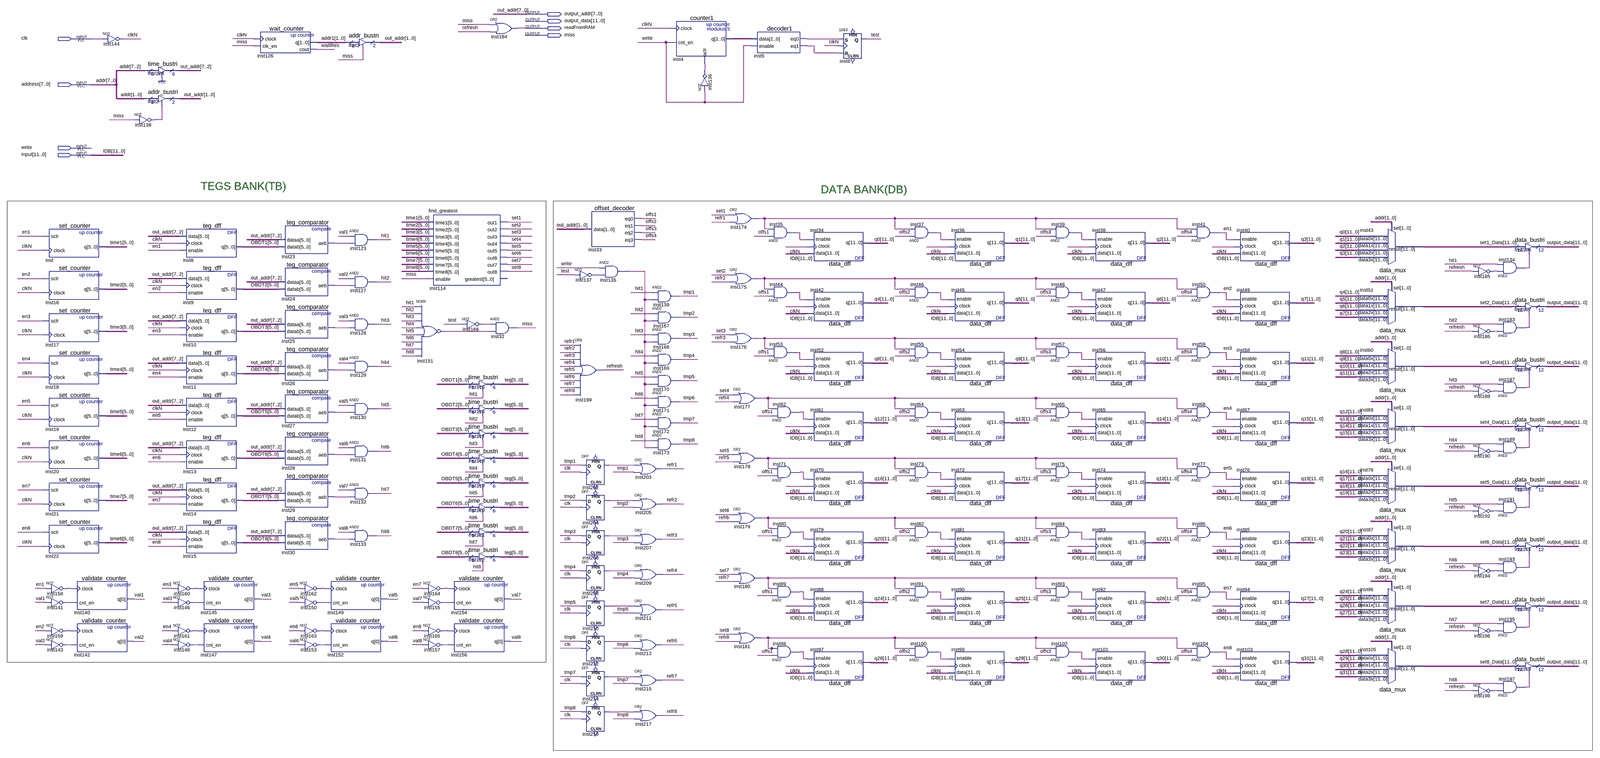
[diagram p0: schematic sheet, whole]
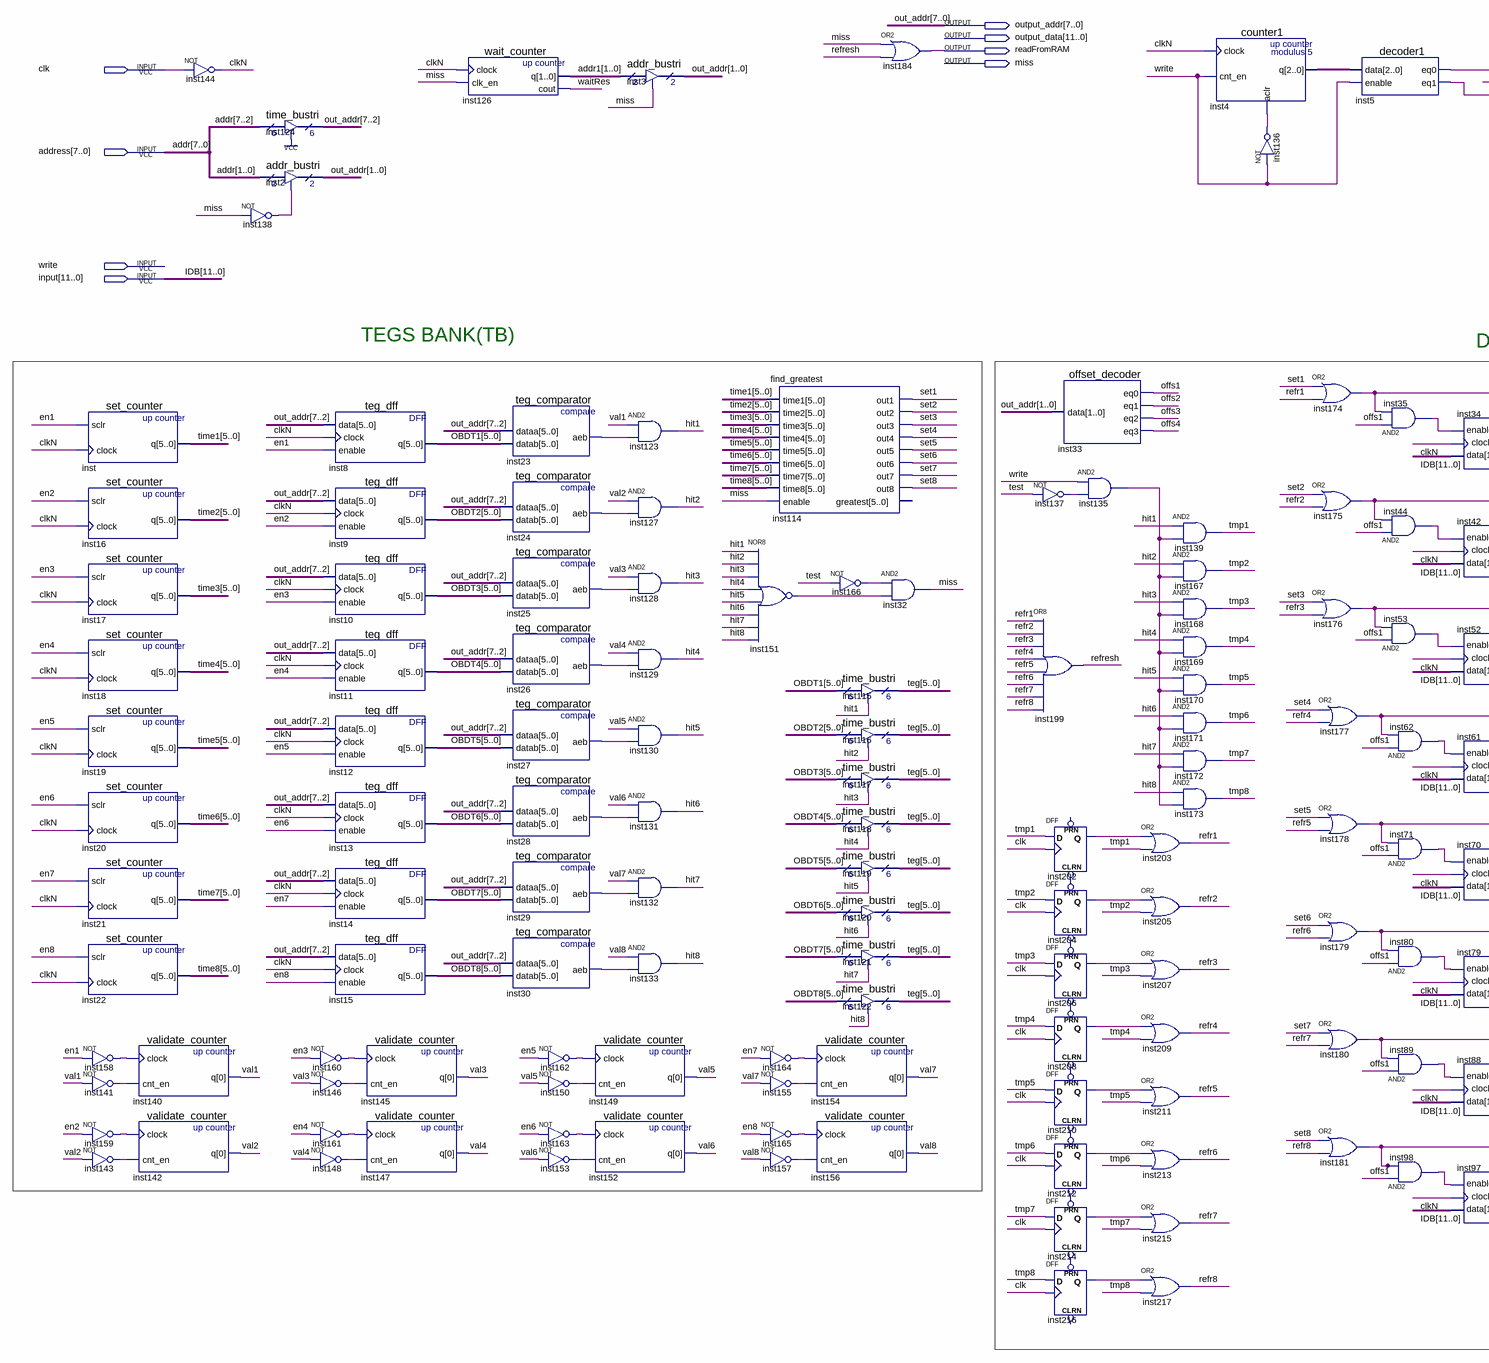
[diagram p1: schematic sheet, left part]
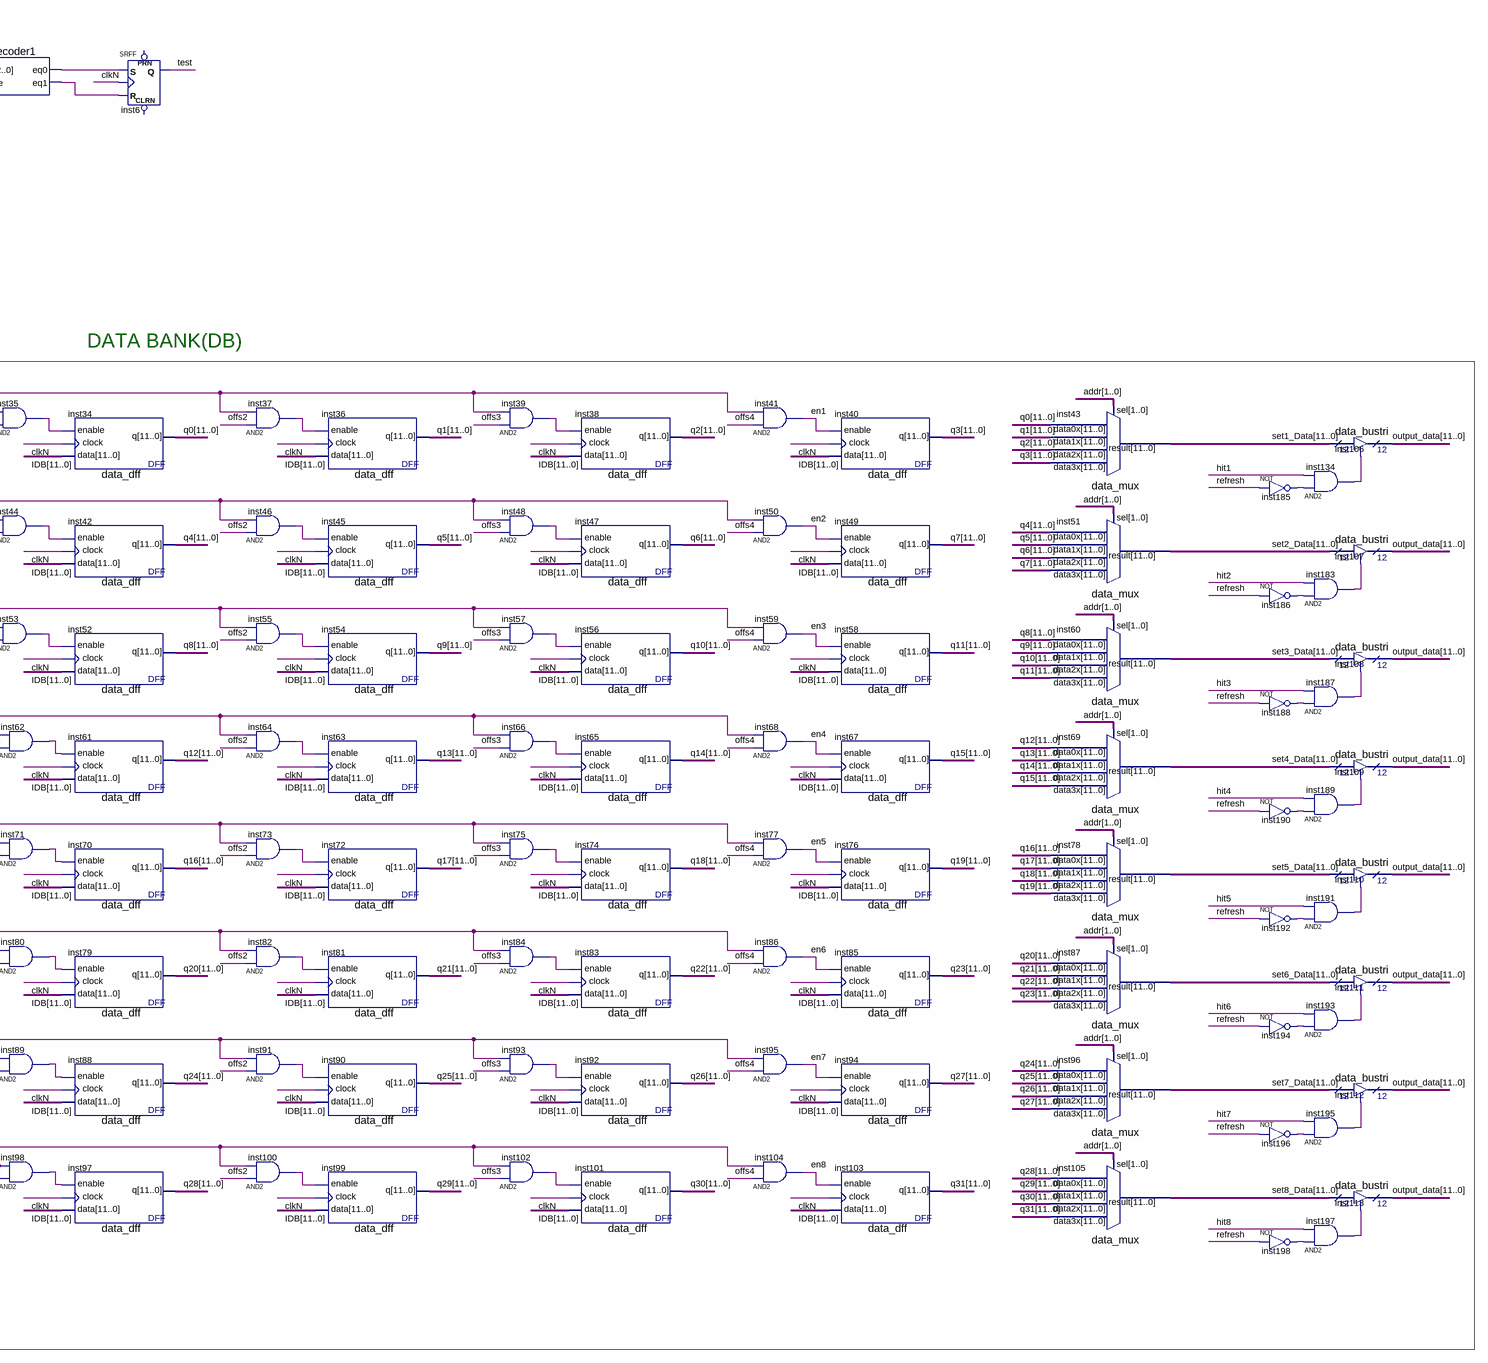
[diagram p2: schematic sheet, right part]
// Quartus schematic Cache.bdf as structural Verilog: 211 symbols, 8 pins
module Cache (
  input  clk,
  input  [7:0] address,
  input  write,
  input  [11:0] \input ,
  output [7:0] output_addr,
  output [11:0] output_data,
  output readFromRAM,
  output miss
);

  wire clkN, en1, en2, en3, en4, en5, en6, en7, en8, hit1, hit2, hit3, hit4, hit5, hit6, hit7, hit8,
       inst5_eq0, inst5_eq1, inst23_aeb, inst24_aeb, inst25_aeb, inst26_aeb, inst27_aeb, inst28_aeb,
       inst29_aeb, inst30_aeb, inst35_out, inst37_out, inst39_out, inst44_out, inst46_out, inst48_out,
       inst53_out, inst55_out, inst57_out, inst62_out, inst64_out, inst66_out, inst71_out, inst73_out,
       inst75_out, inst80_out, inst82_out, inst84_out, inst89_out, inst91_out, inst93_out, inst98_out,
       inst100_out, inst102_out, inst134_out, inst135_out, inst136_out, inst137_out, inst138_out,
       inst141_out, inst143_out, inst146_out, inst148_out, inst150_out, inst151_out, inst153_out,
       inst155_out, inst157_out, inst158_out, inst159_out, inst160_out, inst161_out, inst162_out,
       inst163_out, inst164_out, inst165_out, inst166_out, inst174_out, inst175_out, inst176_out,
       inst177_out, inst178_out, inst179_out, inst180_out, inst181_out, inst183_out, inst185_out,
       inst186_out, inst187_out, inst188_out, inst189_out, inst190_out, inst191_out, inst192_out,
       inst193_out, inst194_out, inst195_out, inst196_out, inst197_out, inst198_out, inst202_q, inst204_q,
       inst206_q, inst208_q, inst210_q, inst212_q, inst214_q, inst216_q, offs1, offs2, offs3, offs4, refr1,
       refr2, refr3, refr4, refr5, refr6, refr7, refr8, refresh, set1, set2, set3, set4, set5, set6, set7,
       set8, test, tmp1, tmp2, tmp3, tmp4, tmp5, tmp6, tmp7, tmp8, undriven, undriven_2, undriven_3,
       undriven_4, undriven_5, undriven_6, undriven_7, val1, val2, val3, val4, val5, val6, val7, val8,
       waitRes;
  wire [1:0] addr1;
  wire [2:0] inst4_q;
  wire [5:0] OBDT1, OBDT2, OBDT3, OBDT4, OBDT5, OBDT6, OBDT7, OBDT8, teg, time1, time2, time3, time4, time5,
       time6, time7, time8;
  wire [11:0] q0, q1, q2, q3, q4, q5, q6, q7, q8, q9, q10, q11, q12, q13, q14, q15, q16, q17, q18, q19, q20,
       q21, q22, q23, q24, q25, q26, q27, q28, q29, q30, q31, set1_Data, set2_Data, set3_Data, set4_Data,
       set5_Data, set6_Data, set7_Data, set8_Data;

  set_counter inst (.sclr(en1), .clock(clkN), .q(time1));
  set_counter inst16 (.sclr(en2), .clock(clkN), .q(time2));
  set_counter inst17 (.sclr(en3), .clock(clkN), .q(time3));
  set_counter inst18 (.sclr(en4), .clock(clkN), .q(time4));
  set_counter inst19 (.sclr(en5), .clock(clkN), .q(time5));
  set_counter inst20 (.sclr(en6), .clock(clkN), .q(time6));
  set_counter inst21 (.sclr(en7), .clock(clkN), .q(time7));
  set_counter inst22 (.sclr(en8), .clock(clkN), .q(time8));
  not inst158 (inst158_out, en1);
  not inst141 (inst141_out, val1);
  not inst159 (inst159_out, en2);
  not inst143 (inst143_out, val2);
  validate_counter inst140 (.clock(inst158_out), .cnt_en(inst141_out), .q(val1));
  validate_counter inst142 (.clock(inst159_out), .cnt_en(inst143_out), .q(val2));
  not inst144 (clkN, clk);
  not inst138 (inst138_out, miss);
  time_bustri inst124 (.enabledt(1'b1), .data(address[7:2]), .tridata(output_addr[7:2]));
  addr_bustri inst2 (.enabledt(inst138_out), .data(address[1:0]), .tridata(output_addr[1:0]));
  teg_dff inst8 (.data(output_addr[7:2]), .clock(clkN), .enable(en1), .q(OBDT1));
  teg_dff inst9 (.data(output_addr[7:2]), .clock(clkN), .enable(en2), .q(OBDT2));
  teg_dff inst10 (.data(output_addr[7:2]), .clock(clkN), .enable(en3), .q(OBDT3));
  teg_dff inst11 (.data(output_addr[7:2]), .clock(clkN), .enable(en4), .q(OBDT4));
  teg_dff inst12 (.data(output_addr[7:2]), .clock(clkN), .enable(en5), .q(OBDT5));
  teg_dff inst13 (.data(output_addr[7:2]), .clock(clkN), .enable(en6), .q(OBDT6));
  teg_dff inst14 (.data(output_addr[7:2]), .clock(clkN), .enable(en7), .q(OBDT7));
  teg_dff inst15 (.data(output_addr[7:2]), .clock(clkN), .enable(en8), .q(OBDT8));
  validate_counter inst145 (.clock(inst160_out), .cnt_en(inst146_out), .q(val3));
  not inst160 (inst160_out, en3);
  not inst146 (inst146_out, val3);
  validate_counter inst147 (.clock(inst161_out), .cnt_en(inst148_out), .q(val4));
  not inst161 (inst161_out, en4);
  not inst148 (inst148_out, val4);
  wait_counter inst126 (.clock(clkN), .clk_en(miss), .q(addr1), .cout(waitRes));
  teg_comparator inst23 (.dataa(output_addr[7:2]), .datab(OBDT1), .aeb(inst23_aeb));
  teg_comparator inst24 (.dataa(output_addr[7:2]), .datab(OBDT2), .aeb(inst24_aeb));
  teg_comparator inst25 (.dataa(output_addr[7:2]), .datab(OBDT3), .aeb(inst25_aeb));
  teg_comparator inst26 (.dataa(output_addr[7:2]), .datab(OBDT4), .aeb(inst26_aeb));
  teg_comparator inst27 (.dataa(output_addr[7:2]), .datab(OBDT5), .aeb(inst27_aeb));
  teg_comparator inst28 (.dataa(output_addr[7:2]), .datab(OBDT6), .aeb(inst28_aeb));
  teg_comparator inst29 (.dataa(output_addr[7:2]), .datab(OBDT7), .aeb(inst29_aeb));
  teg_comparator inst30 (.dataa(output_addr[7:2]), .datab(OBDT8), .aeb(inst30_aeb));
  not inst162 (inst162_out, en5);
  not inst150 (inst150_out, val5);
  not inst163 (inst163_out, en6);
  not inst153 (inst153_out, val6);
  validate_counter inst149 (.clock(inst162_out), .cnt_en(inst150_out), .q(val5));
  validate_counter inst152 (.clock(inst163_out), .cnt_en(inst153_out), .q(val6));
  addr_bustri inst3 (.enabledt(miss), .data(addr1), .tridata(output_addr[1:0]));
  and inst123 (hit1, val1, inst23_aeb);
  and inst127 (hit2, val2, inst24_aeb);
  and inst128 (hit3, val3, inst25_aeb);
  and inst129 (hit4, val4, inst26_aeb);
  and inst130 (hit5, val5, inst27_aeb);
  and inst131 (hit6, val6, inst28_aeb);
  and inst132 (hit7, val7, inst29_aeb);
  and inst133 (hit8, val8, inst30_aeb);
  nor inst151 (inst151_out, hit1, hit2, hit3, hit4, hit5, hit6, hit7, hit8);
  not inst164 (inst164_out, en7);
  not inst155 (inst155_out, val7);
  not inst165 (inst165_out, en8);
  not inst157 (inst157_out, val8);
  find_greatest inst114 (
    .time1(time1), .time2(time2), .time3(time3), .time4(time4), .time5(time5), .time6(time6), .time7(time7),
    .time8(time8), .enable(miss), .out1(set1), .out2(set2), .out3(set3), .out4(set4), .out5(set5),
    .out6(set6), .out7(set7), .out8(set8));  // open: greatest
  validate_counter inst154 (.clock(inst164_out), .cnt_en(inst155_out), .q(val7));
  validate_counter inst156 (.clock(inst165_out), .cnt_en(inst157_out), .q(val8));
  not inst166 (inst166_out, test);
  time_bustri inst115 (.enabledt(hit1), .data(OBDT1), .tridata(teg));
  time_bustri inst116 (.enabledt(hit2), .data(OBDT2), .tridata(teg));
  time_bustri inst117 (.enabledt(hit3), .data(OBDT3), .tridata(teg));
  time_bustri inst118 (.enabledt(hit4), .data(OBDT4), .tridata(teg));
  time_bustri inst119 (.enabledt(hit5), .data(OBDT5), .tridata(teg));
  time_bustri inst120 (.enabledt(hit6), .data(OBDT6), .tridata(teg));
  time_bustri inst121 (.enabledt(hit7), .data(OBDT7), .tridata(teg));
  time_bustri inst122 (.enabledt(hit8), .data(OBDT8), .tridata(teg));
  or inst184 (readFromRAM, miss, refresh);
  and inst32 (miss, inst166_out, inst151_out);
  offset_decoder inst33 (.data(output_addr[1:0]), .eq0(offs1), .eq1(offs2), .eq2(offs3), .eq3(offs4));
  not inst137 (inst137_out, test);
  or inst199 (refresh, refr1, refr2, refr3, refr4, refr5, refr6, refr7, refr8);
  DFF inst202 (.CLRN(undriven_7), .CLK(clk), .D(tmp1), .Q(inst202_q));  // open: PRN
  DFF inst204 (.CLRN(undriven_6), .CLK(clk), .D(tmp2), .PRN(undriven_7), .Q(inst204_q));
  DFF inst206 (.CLRN(undriven_5), .CLK(clk), .D(tmp3), .PRN(undriven_6), .Q(inst206_q));
  DFF inst208 (.CLRN(undriven_4), .CLK(clk), .D(tmp4), .PRN(undriven_5), .Q(inst208_q));
  DFF inst210 (.CLRN(undriven_3), .CLK(clk), .D(tmp5), .PRN(undriven_4), .Q(inst210_q));
  DFF inst212 (.CLRN(undriven_2), .CLK(clk), .D(tmp6), .PRN(undriven_3), .Q(inst212_q));
  DFF inst214 (.CLRN(undriven), .CLK(clk), .D(tmp7), .PRN(undriven_2), .Q(inst214_q));
  DFF inst216 (.CLK(clk), .D(tmp8), .PRN(undriven), .Q(inst216_q));  // open: CLRN
  and inst135 (inst135_out, write, inst137_out);
  or inst203 (refr1, inst202_q, tmp1);
  or inst205 (refr2, inst204_q, tmp2);
  or inst207 (refr3, inst206_q, tmp3);
  or inst209 (refr4, inst208_q, tmp4);
  or inst211 (refr5, inst210_q, tmp5);
  or inst213 (refr6, inst212_q, tmp6);
  or inst215 (refr7, inst214_q, tmp7);
  or inst217 (refr8, inst216_q, tmp8);
  counter1 inst4 (.clock(clkN), .cnt_en(write), .aclr(inst136_out), .q(inst4_q));
  and inst139 (tmp1, hit1, inst135_out);
  and inst167 (tmp2, hit2, inst135_out);
  and inst168 (tmp3, hit3, inst135_out);
  and inst169 (tmp4, hit4, inst135_out);
  and inst170 (tmp5, hit5, inst135_out);
  and inst171 (tmp6, hit6, inst135_out);
  and inst172 (tmp7, hit7, inst135_out);
  and inst173 (tmp8, hit8, inst135_out);
  not inst136 (inst136_out, write);
  or inst174 (inst174_out, set1, refr1);
  or inst175 (inst175_out, set2, refr2);
  or inst176 (inst176_out, set3, refr3);
  or inst177 (inst177_out, set4, refr4);
  or inst178 (inst178_out, set5, refr5);
  or inst179 (inst179_out, set6, refr6);
  or inst180 (inst180_out, set7, refr7);
  or inst181 (inst181_out, set8, refr8);
  decoder1 inst5 (.data(inst4_q), .enable(write), .eq0(inst5_eq0), .eq1(inst5_eq1));
  and inst35 (inst35_out, offs1, inst174_out);
  and inst44 (inst44_out, offs1, inst175_out);
  and inst53 (inst53_out, offs1, inst176_out);
  and inst62 (inst62_out, offs1, inst177_out);
  and inst71 (inst71_out, offs1, inst178_out);
  and inst80 (inst80_out, offs1, inst179_out);
  and inst89 (inst89_out, offs1, inst180_out);
  and inst98 (inst98_out, offs1, inst181_out);
  data_dff inst34 (.data(\input ), .clock(clkN), .enable(inst35_out), .q(q0));
  data_dff inst42 (.data(\input ), .clock(clkN), .enable(inst44_out), .q(q4));
  data_dff inst52 (.data(\input ), .clock(clkN), .enable(inst53_out), .q(q8));
  data_dff inst61 (.data(\input ), .clock(clkN), .enable(inst62_out), .q(q12));
  data_dff inst70 (.data(\input ), .clock(clkN), .enable(inst71_out), .q(q16));
  data_dff inst79 (.data(\input ), .clock(clkN), .enable(inst80_out), .q(q20));
  data_dff inst88 (.data(\input ), .clock(clkN), .enable(inst89_out), .q(q24));
  data_dff inst97 (.data(\input ), .clock(clkN), .enable(inst98_out), .q(q28));
  SRFF inst6 (.S(inst5_eq0), .R(inst5_eq1), .CLK(clkN), .Q(test));  // open: PRN, CLRN
  and inst37 (inst37_out, offs2, inst174_out);
  and inst46 (inst46_out, offs2, inst175_out);
  and inst55 (inst55_out, offs2, inst176_out);
  and inst64 (inst64_out, offs2, inst177_out);
  and inst73 (inst73_out, offs2, inst178_out);
  and inst82 (inst82_out, offs2, inst179_out);
  and inst91 (inst91_out, offs2, inst180_out);
  and inst100 (inst100_out, offs2, inst181_out);
  data_dff inst36 (.data(\input ), .clock(clkN), .enable(inst37_out), .q(q1));
  data_dff inst45 (.data(\input ), .clock(clkN), .enable(inst46_out), .q(q5));
  data_dff inst54 (.data(\input ), .clock(clkN), .enable(inst55_out), .q(q9));
  data_dff inst63 (.data(\input ), .clock(clkN), .enable(inst64_out), .q(q13));
  data_dff inst72 (.data(\input ), .clock(clkN), .enable(inst73_out), .q(q17));
  data_dff inst81 (.data(\input ), .clock(clkN), .enable(inst82_out), .q(q21));
  data_dff inst90 (.data(\input ), .clock(clkN), .enable(inst91_out), .q(q25));
  data_dff inst99 (.data(\input ), .clock(clkN), .enable(inst100_out), .q(q29));
  and inst39 (inst39_out, offs3, inst174_out);
  and inst48 (inst48_out, offs3, inst175_out);
  and inst57 (inst57_out, offs3, inst176_out);
  and inst66 (inst66_out, offs3, inst177_out);
  and inst75 (inst75_out, offs3, inst178_out);
  and inst84 (inst84_out, offs3, inst179_out);
  and inst93 (inst93_out, offs3, inst180_out);
  and inst102 (inst102_out, offs3, inst181_out);
  data_dff inst38 (.data(\input ), .clock(clkN), .enable(inst39_out), .q(q2));
  data_dff inst47 (.data(\input ), .clock(clkN), .enable(inst48_out), .q(q6));
  data_dff inst56 (.data(\input ), .clock(clkN), .enable(inst57_out), .q(q10));
  data_dff inst65 (.data(\input ), .clock(clkN), .enable(inst66_out), .q(q14));
  data_dff inst74 (.data(\input ), .clock(clkN), .enable(inst75_out), .q(q18));
  data_dff inst83 (.data(\input ), .clock(clkN), .enable(inst84_out), .q(q22));
  data_dff inst92 (.data(\input ), .clock(clkN), .enable(inst93_out), .q(q26));
  data_dff inst101 (.data(\input ), .clock(clkN), .enable(inst102_out), .q(q30));
  and inst41 (en1, offs4, inst174_out);
  and inst50 (en2, offs4, inst175_out);
  and inst59 (en3, offs4, inst176_out);
  and inst68 (en4, offs4, inst177_out);
  and inst77 (en5, offs4, inst178_out);
  and inst86 (en6, offs4, inst179_out);
  and inst95 (en7, offs4, inst180_out);
  and inst104 (en8, offs4, inst181_out);
  data_dff inst40 (.data(\input ), .clock(clkN), .enable(en1), .q(q3));
  data_dff inst49 (.data(\input ), .clock(clkN), .enable(en2), .q(q7));
  data_dff inst58 (.data(\input ), .clock(clkN), .enable(en3), .q(q11));
  data_dff inst67 (.data(\input ), .clock(clkN), .enable(en4), .q(q15));
  data_dff inst76 (.data(\input ), .clock(clkN), .enable(en5), .q(q19));
  data_dff inst85 (.data(\input ), .clock(clkN), .enable(en6), .q(q23));
  data_dff inst94 (.data(\input ), .clock(clkN), .enable(en7), .q(q27));
  data_dff inst103 (.data(\input ), .clock(clkN), .enable(en8), .q(q31));
  data_mux inst43 (.data3x(q3), .data2x(q2), .data1x(q1), .data0x(q0), .sel(address[1:0]), .result(set1_Data));
  data_mux inst51 (.data3x(q7), .data2x(q6), .data1x(q5), .data0x(q4), .sel(address[1:0]), .result(set2_Data));
  data_mux inst60 (.data3x(q11), .data2x(q10), .data1x(q9), .data0x(q8), .sel(address[1:0]), .result(set3_Data));
  data_mux inst69 (.data3x(q15), .data2x(q14), .data1x(q13), .data0x(q12), .sel(address[1:0]), .result(set4_Data));
  data_mux inst78 (.data3x(q19), .data2x(q18), .data1x(q17), .data0x(q16), .sel(address[1:0]), .result(set5_Data));
  data_mux inst87 (.data3x(q23), .data2x(q22), .data1x(q21), .data0x(q20), .sel(address[1:0]), .result(set6_Data));
  data_mux inst96 (.data3x(q27), .data2x(q26), .data1x(q25), .data0x(q24), .sel(address[1:0]), .result(set7_Data));
  data_mux inst105 (.data3x(q31), .data2x(q30), .data1x(q29), .data0x(q28), .sel(address[1:0]), .result(set8_Data));
  not inst185 (inst185_out, refresh);
  not inst186 (inst186_out, refresh);
  not inst188 (inst188_out, refresh);
  not inst190 (inst190_out, refresh);
  not inst192 (inst192_out, refresh);
  not inst194 (inst194_out, refresh);
  not inst196 (inst196_out, refresh);
  not inst198 (inst198_out, refresh);
  data_bustri inst106 (.enabledt(inst134_out), .data(set1_Data), .tridata(output_data));
  and inst134 (inst134_out, inst185_out, hit1);
  data_bustri inst107 (.enabledt(inst183_out), .data(set2_Data), .tridata(output_data));
  and inst183 (inst183_out, inst186_out, hit2);
  data_bustri inst108 (.enabledt(inst187_out), .data(set3_Data), .tridata(output_data));
  and inst187 (inst187_out, inst188_out, hit3);
  data_bustri inst109 (.enabledt(inst189_out), .data(set4_Data), .tridata(output_data));
  and inst189 (inst189_out, inst190_out, hit4);
  data_bustri inst110 (.enabledt(inst191_out), .data(set5_Data), .tridata(output_data));
  and inst191 (inst191_out, inst192_out, hit5);
  data_bustri inst111 (.enabledt(inst193_out), .data(set6_Data), .tridata(output_data));
  and inst193 (inst193_out, inst194_out, hit6);
  data_bustri inst112 (.enabledt(inst195_out), .data(set7_Data), .tridata(output_data));
  and inst195 (inst195_out, inst196_out, hit7);
  data_bustri inst113 (.enabledt(inst197_out), .data(set8_Data), .tridata(output_data));
  and inst197 (inst197_out, inst198_out, hit8);

  // Other names for the same wires on the sheet: addr[7:0] = address; IDB[11:0] = \input ;
  //   out_addr[7:0] = output_addr

  // Notes on the sheet:
  //   TEGS BANK(TB)
  //   DATA BANK(DB)
endmodule
